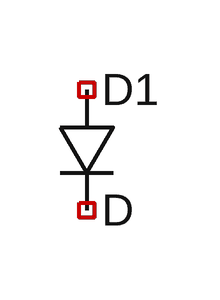
[diagram p0: schematic Draft1.asc]
Draft1.asc, the LTspice schematic file:
Version 4
SHEET 1 880 680
SYMBOL diode 160 176 R0
SYMATTR InstName D1

The netlist it stands for:
* Draft1.asc
D1 NC_01 NC_02 D
.model D D
.lib standard.dio
.backanno
.end